# EAGLE design match4 (EAGLE 7.2.0)
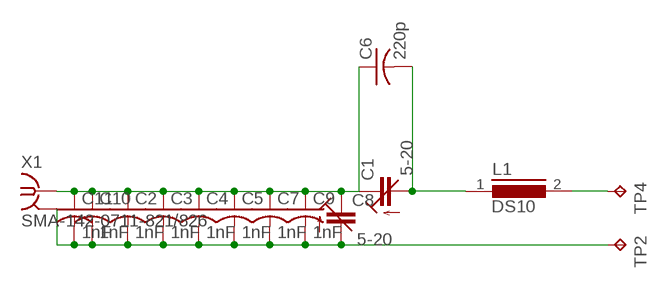
[diagram p0: schematic, sheet 1]

## Parts
C1  5-20  C-TRIMM  [SGC3S]
C2  1nF  C-US  [1111]
C3  1nF  C-US  [1111]
C4  1nF  C-US  [1111]
C5  1nF  C-US  [1111]
C6  220p  C-US  [1111]
C7  1nF  C-US  [1111]
C8  5-20  C-TRIMM  [SGC3S]
C9  1nF  C-US  [1111]
C10  1nF  C-US  [1111]
C11  1nF  C-US  [1111]
L1  DS10  [DS10]
TP2  TPPAD1-13Y  [P1-13Y]
TP4  TPPAD1-13Y  [P1-13Y]
X1  SMA-142-0711-821/826  [J502-ND-142-0711-821/826]

## Nets
N$1: C1.P$1(A) C6.P$2 L1.1
N$2: C2.P$2 C3.P$2 C4.P$2 C5.P$2 C7.P$2 C8.P$1(A) C9.P$2 C10.P$2 C11.P$2 TP2.TP X1.G@1 X1.G@2 X1.G@3 X1.G@4
N$3: L1.2 TP4.TP
N$7: C1.P$2(E) C2.P$1 C3.P$1 C4.P$1 C5.P$1 C6.P$1 C7.P$1 C8.P$2(E) C9.P$1 C10.P$1 C11.P$1 X1.1

## Library data of the parts
C1 C8 = sprague:C-TRIMM: Trimm capacitor
C2-C7 C9-C11 = resistor:C-US: CAPACITOR, American symbol
L1 = inductors:DS10: INDUCTOR
TP2 TP4 = testpad:TP: Test pad
X1 = con-coax:SMA-: SMA 50 Ohm End Launch Jack Receptacle - Round Contact Johnson Components Source: www.johnsoncomponents.com .. J502-ND.pdf; MF: JOHNSON COMPONENTS; MPN: 142-0711-821; OC_FARNELL: 1019328; OC_NEWARK: 16F3627

## Board
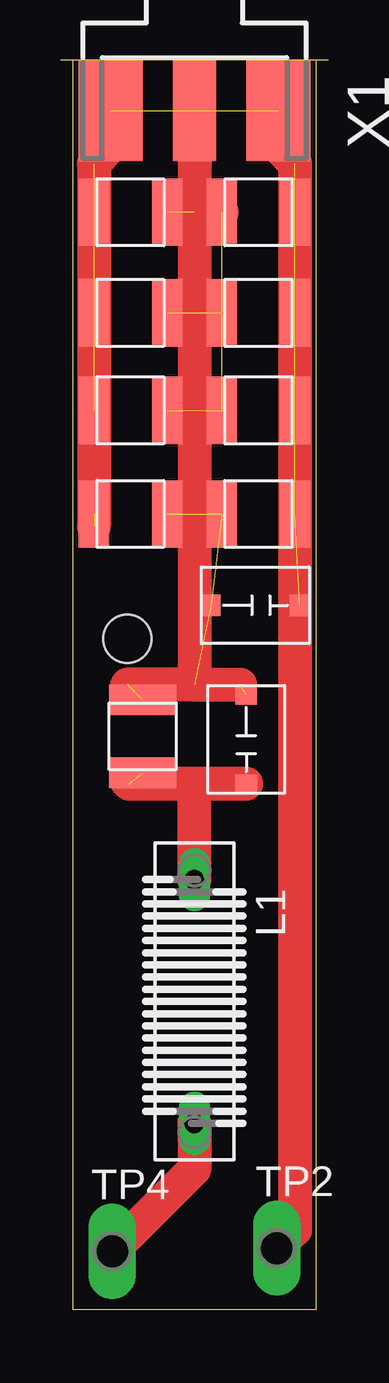
[diagram p1: board, top side]
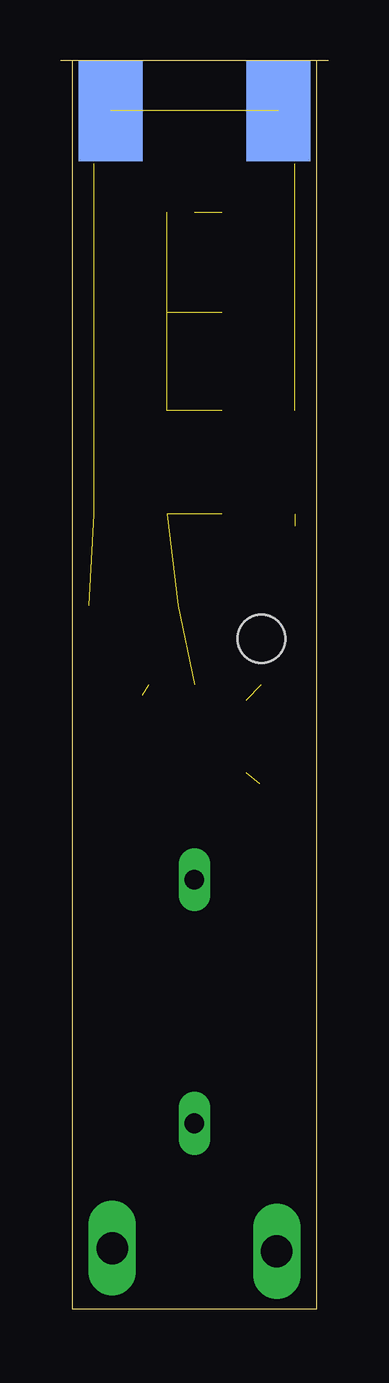
[diagram p2: board, bottom side, seen from below]

Size 10.16 x 52.07 mm. Coordinates in mm from the lower left corner, seen from the top.
Outline: 0,0 10.16,0 10.16,52.07 0,52.07 0,0
Copper layers (1*16): Top 0.035mm / dielectric 1.5mm / Bottom 0.035mm
Design rules "default": minimum track width 10mil, minimum drill 24mil, track to track 8mil, track to pad 8mil, pad to pad 8mil, via to via 8mil, smd to smd 8mil, copper to edge 40mil, drill to drill 8mil, minimum pad ring 10mil, minimum via ring 8mil, stop-mask expansion 4mil, vias tented up to drill 0mil, thermal gap 10mil
Holes 2 mm at 2.29,27.94

### Footprints (pad centres in the part's own frame; a part is rotated, then mirrored left to right if it is on the bottom)
SGC3S = smd 0.9 x 0.8: P$1 0,1.85; P$2 0,-1.85
1111 = smd 1.27 x 2.794: P$1 -1.524,0; P$2 1.524,0
DS10 = drill 0.813 long: 1 -5.08,0; 2 5.08,0
P1-13Y = drill 1.321 pad 1.905 long: TP 0,0
J502-ND-142-0711-821/826 = smd 4.191 x 1.778: 1 2.115,0 | smd 4.191 x 2.667: G@1 2.115,3.495; G@2 2.115,-3.495 | smd 4.191 x 2.667 bottom: G@3 2.115,3.495; G@4 2.115,-3.495

### Placement (x,y rotation side)
C1  7.24,23.75 180 top
C2  7.75,45.72 0 top
C3  7.75,41.53 0 top
C4  7.75,37.47 0 top
C5  7.75,33.15 0 top
C6  2.92,23.88 270 top
C7  2.41,45.72 180 top
C8  7.62,29.34 270 top
C9  2.41,41.53 180 top
C10  2.41,37.47 180 top
C11  2.41,33.15 180 top
L1  5.08,12.83 270 top
TP2  8.51,2.54 0 top
TP4  1.65,2.41 0 top
X1  5.08,52.07 270 top

### Tracks (layer width: path | path; a pad name or v marks a point on that pad's centre or on a via)
N$1  (1 unrouted)
  Top 1.422: C1.P$1 5.21,21.9 | 5.21,21.9 2.36,21.9 2.29,21.97 | L1.1 5.08,21.77 5.21,21.9
N$2  (12 unrouted)
  Top 1.422: 8.57,48.83 8.57,48.45 9.27,47.75 9.27,3.3 TP2.TP | X1.G@4 1.58,48.45 0.89,47.75 0.89,32.64
  Top 1.676: X1.G@3 8.57,48.83
N$3
  Top 1.422: L1.2 5.08,5.84 TP4.TP
N$7  (10 unrouted)
  Top 1.422: X1.1 5.08,45.72 | C2.P$1 5.08,45.72 | 5.08,45.72 5.08,26.04 | 5.08,26.04 6.99,26.04 | 5.08,26.04 2.29,26.04